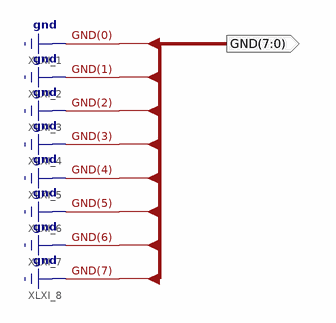
[diagram p0: schematic sheet 1]
// Xilinx ISE schematic gnd8.sch (spartan6) as structural Verilog: 0 symbols, 1 ports
module gnd8 (
  output [7:0] GND
);


  assign GND = {8{1'b0}};
endmodule
